# EAGLE design GPS_mk2 (EAGLE 8.4.0)
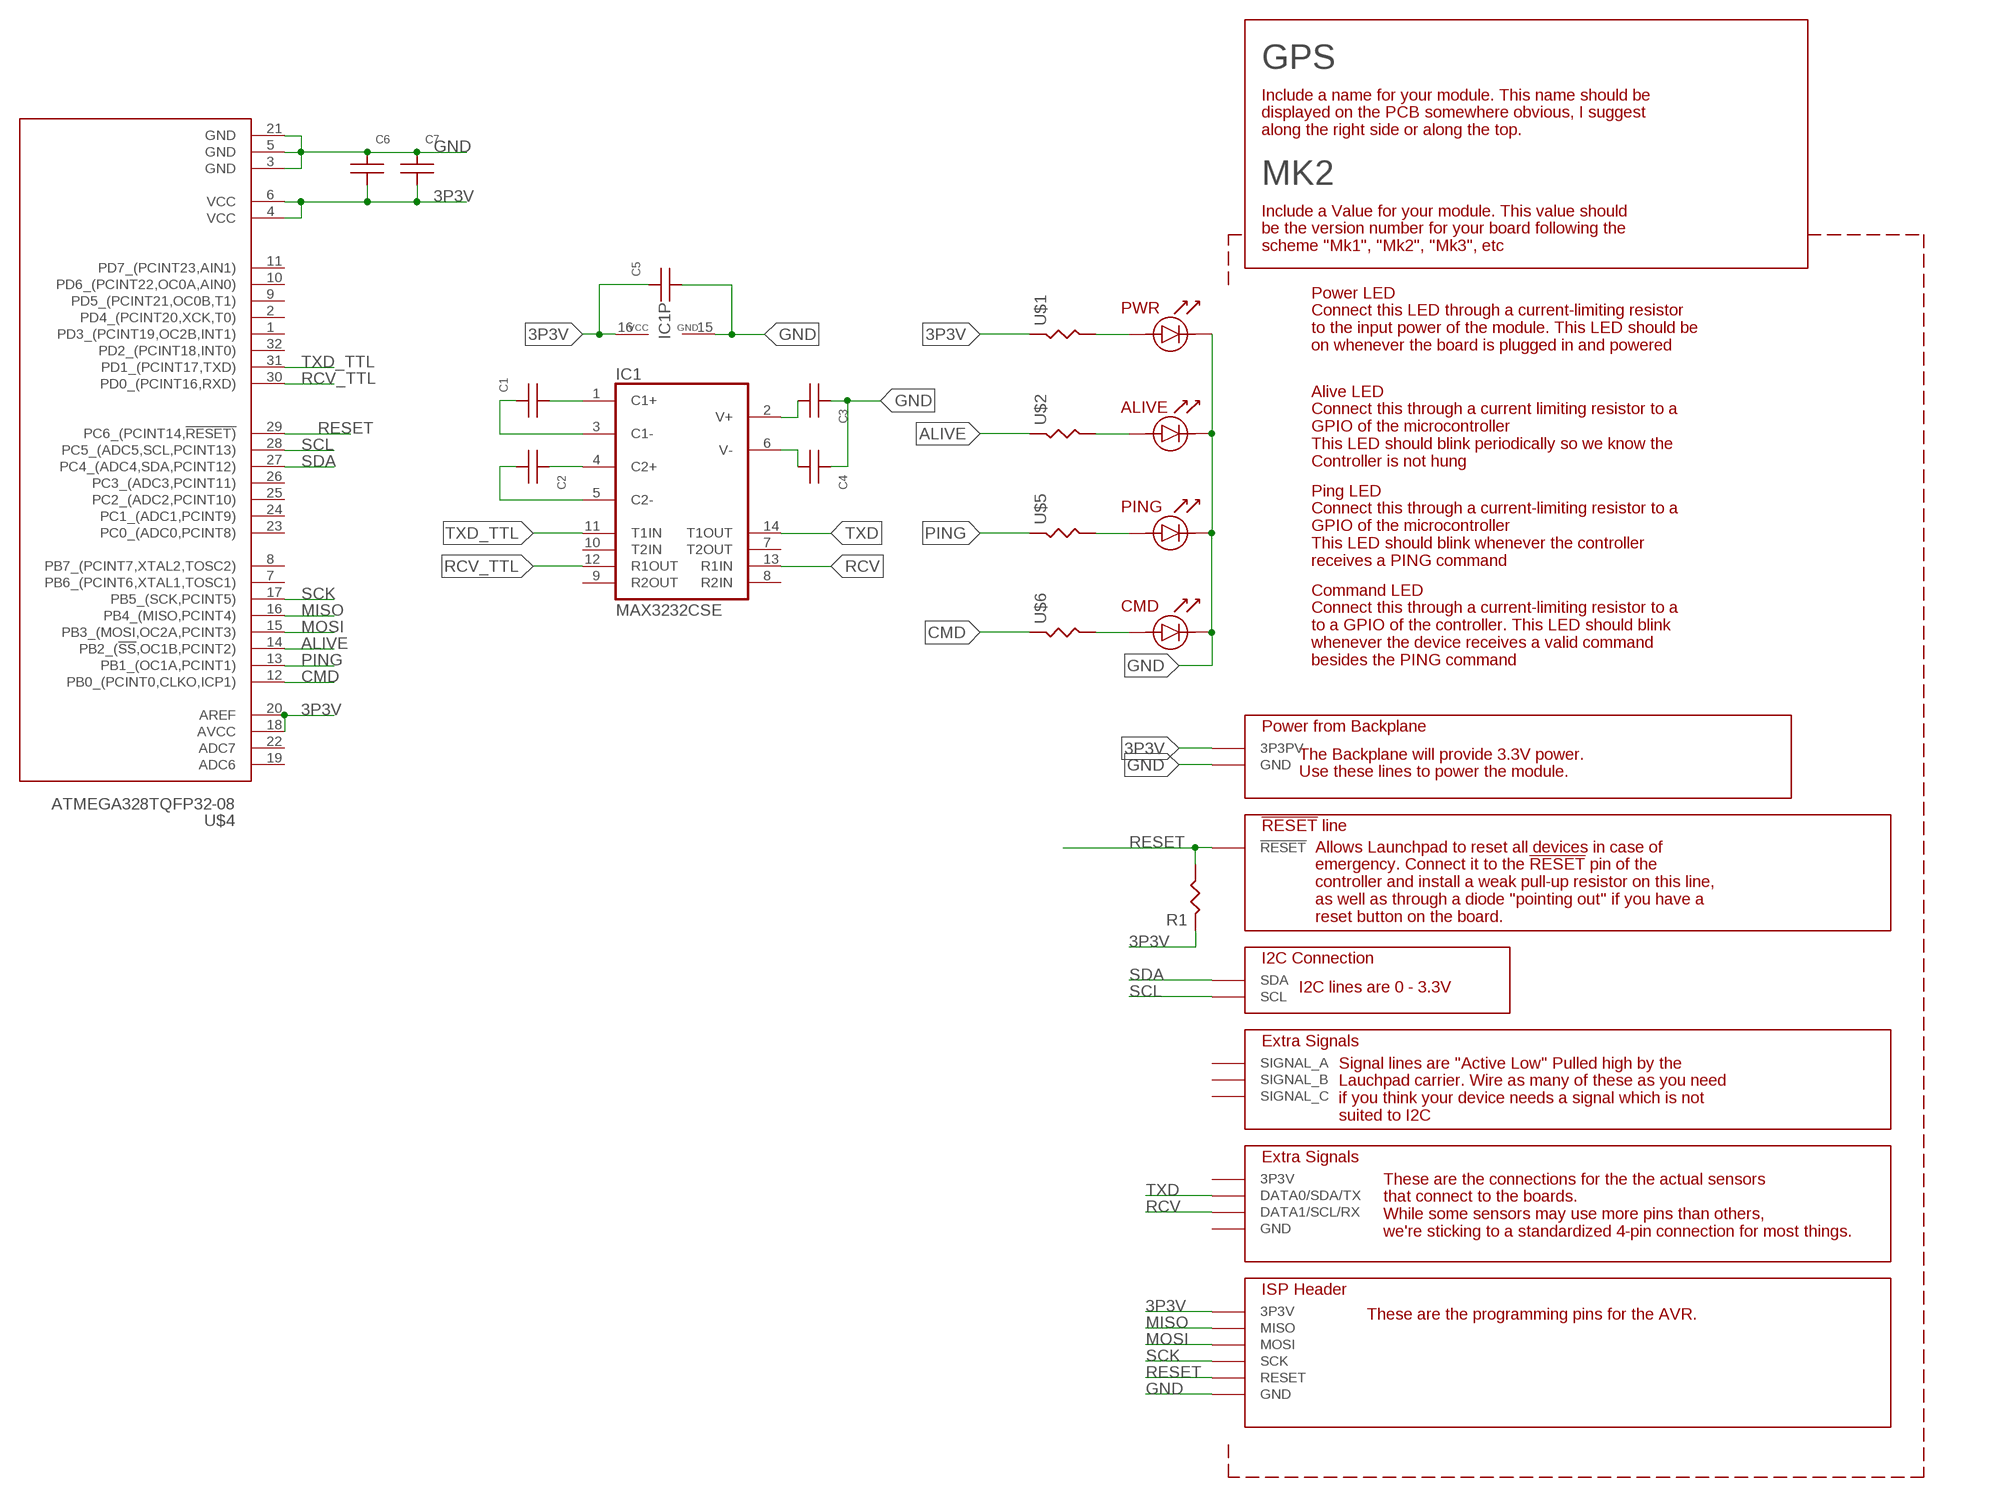
[diagram p0: schematic, sheet 1]

## Parts
C1  CAPACITOR-UNPOLARIZED0805  [0805_STACKPOLERESISTOR]
C2  CAPACITOR-UNPOLARIZED0805  [0805_STACKPOLERESISTOR]
C3  CAPACITOR-UNPOLARIZED0805  [0805_STACKPOLERESISTOR]
C4  CAPACITOR-UNPOLARIZED0805  [0805_STACKPOLERESISTOR]
C5  CAPACITOR-UNPOLARIZED0805  [0805_STACKPOLERESISTOR]
C6  CAPACITOR-UNPOLARIZED0805  [0805_STACKPOLERESISTOR]
C7  CAPACITOR-UNPOLARIZED0805  [0805_STACKPOLERESISTOR]
GPS  MK2  SENSOR_MODULE_MK1  [SENSOR_MODULE_MK1]
IC1  MAX3232CSE  [SO16]
R1  RESISTOR  [0805_STACKPOLERESISTOR]
U$1  RESISTOR  [0805_STACKPOLERESISTOR]
U$2  RESISTOR  [0805_STACKPOLERESISTOR]
U$4  ATMEGA328TQFP32-08  [TQFP32-08]
U$5  RESISTOR  [0805_STACKPOLERESISTOR]
U$6  RESISTOR  [0805_STACKPOLERESISTOR]

## Nets
3P3V: C5.P$1 C6.P$2 C7.P$2 GPS.3P3V@1(3P3PV) GPS.3P3V@4(3P3V) IC1.16(VCC) R1.P$1 U$1.P$1 U$4.4(VCC) U$4.6(VCC) U$4.18(AVCC) U$4.20(AREF)
ALIVE: U$2.P$1 U$4.14(PB2_(!SS,OC1B,PCINT2))
CMD: U$4.12(PB0_(PCINT0,CLKO,ICP1)) U$6.P$1
GND: C3.P$1 C4.P$1 C5.P$2 C6.P$1 C7.P$1 GPS.ALIVELED_CATHODE GPS.CMDLED_CATHODE GPS.GND@1(GND) GPS.GND@4(GND) GPS.PINGLED_CATHODE GPS.PWRLED_CATHODE IC1.15(GND) U$4.3(GND) U$4.5(GND) U$4.21(GND)
MISO: GPS.MISO U$4.16(PB4_(MISO,PCINT4))
MOSI: GPS.MOSI U$4.15(PB3_(MOSI,OC2A,PCINT3))
N$1: C1.P$2 IC1.1(C1+)
N$2: C2.P$1 IC1.4(C2+)
N$3: C1.P$1 IC1.3(C1-)
N$4: C2.P$2 IC1.5(C2-)
N$6: C4.P$2 IC1.6(V-)
N$7: GPS.ALIVELED_ANODE U$2.P$2
N$8: GPS.PWRLED_ANODE U$1.P$2
N$9: GPS.PINGLED_ANODE U$5.P$2
N$10: GPS.CMDLED_ANODE U$6.P$2
N$11: C3.P$2 IC1.2(V+)
PING: U$4.13(PB1_(OC1A,PCINT1)) U$5.P$1
RCV: GPS.DATA1@1(DATA1/SCL/RX) GPS.DATA1@2(DATA1/SCL/RX) IC1.13(R1IN)
RCV_TTL: IC1.12(R1OUT) U$4.30(PD0_(PCINT16,RXD))
RESET: GPS.RESET@1(!RESET) GPS.RESET@2(RESET) R1.P$2 U$4.29(PC6_(PCINT14,!RESET))
SCK: GPS.SCK U$4.17(PB5_(SCK,PCINT5))
SCL: GPS.SCL U$4.28(PC5_(ADC5,SCL,PCINT13))
SDA: GPS.SDA U$4.27(PC4_(ADC4,SDA,PCINT12))
TXD: GPS.DATA0@1(DATA0/SDA/TX) GPS.DATA0@2(DATA0/SDA/TX) IC1.14(T1OUT)
TXD_TTL: IC1.11(T1IN) U$4.31(PD1_(PCINT17,TXD))
Unconnected: GPS.3P3V@2(3P3V) GPS.3P3V@3(3P3V) GPS.A(SIGNAL_A) GPS.B(SIGNAL_B) GPS.C(SIGNAL_C) GPS.GND@2(GND) GPS.GND@3(GND) IC1.7(T2OUT) IC1.8(R2IN) IC1.9(R2OUT) IC1.10(T2IN) U$4.1(PD3_(PCINT19,OC2B,INT1)) U$4.2(PD4_(PCINT20,XCK,T0)) U$4.7(PB6_(PCINT6,XTAL1,TOSC1)) U$4.8(PB7_(PCINT7,XTAL2,TOSC2)) U$4.9(PD5_(PCINT21,OC0B,T1)) U$4.10(PD6_(PCINT22,OC0A,AIN0)) U$4.11(PD7_(PCINT23,AIN1)) U$4.19(ADC6) U$4.22(ADC7) U$4.23(PC0_(ADC0,PCINT8)) U$4.24(PC1_(ADC1,PCINT9)) U$4.25(PC2_(ADC2,PCINT10)) U$4.26(PC3_(ADC3,PCINT11)) U$4.32(PD2_(PCINT18,INT0))

## Library data of the parts
C1-C7 = 000_CustomPartsMaster:CAPACITOR-UNPOLARIZED
GPS = 000_CustomPartsMaster:SENSOR_MODULE_MK1
IC1 = maxim:MAX3232*: True RS-232 Transceivers 3.0V to 5.5V, Low-Power up to 1Mbps, Using Four 0.1µF External Capacitors Source: http://pdfserv.maxim-ic.com/en/ds/MAX3222-MAX3241.pdf; MPN: MAX3232CSE; OC_FARNELL: 9725490; OC_NEWARK: 90C2890
R1 U$1 U$2 U$5 U$6 = 000_CustomPartsMaster:RESISTOR
U$4 = 000_CustomPartsMaster:ATMEGA328

## Board
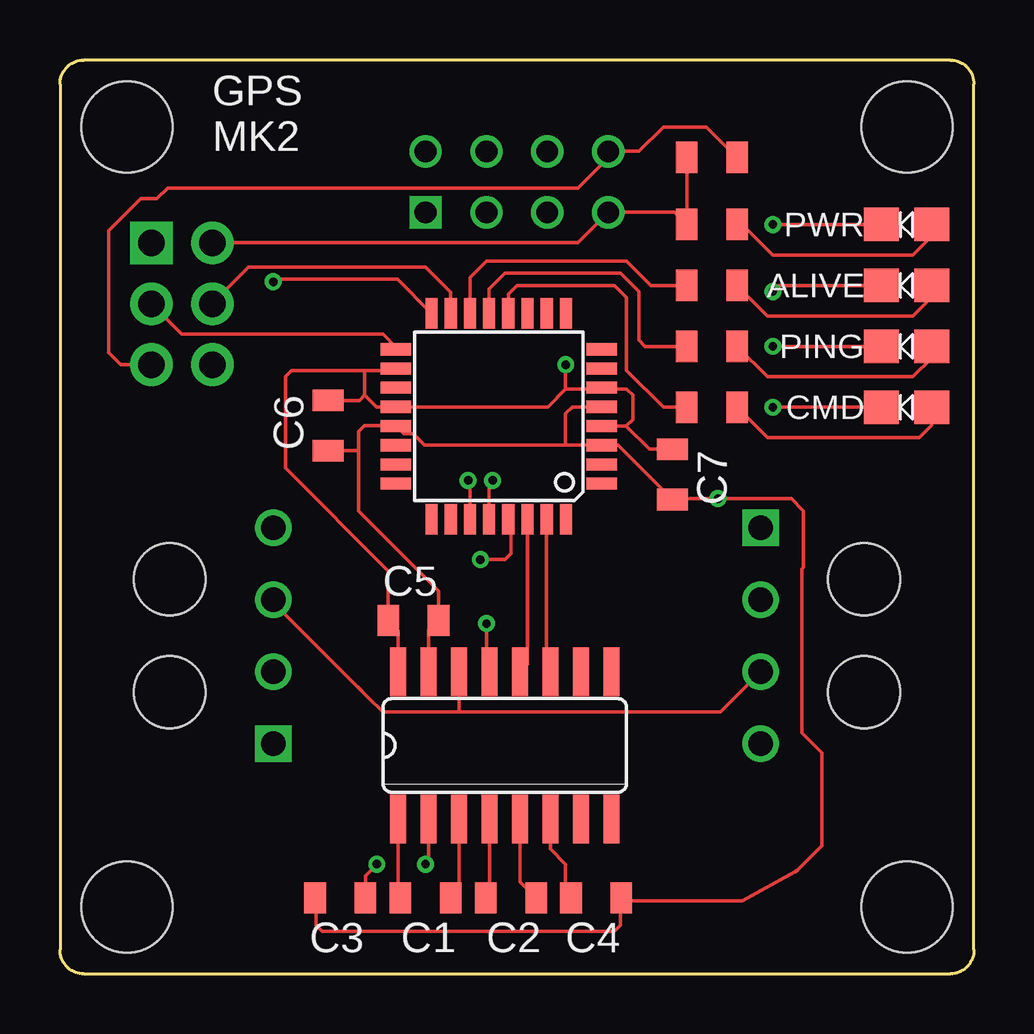
[diagram p1: board, top side]
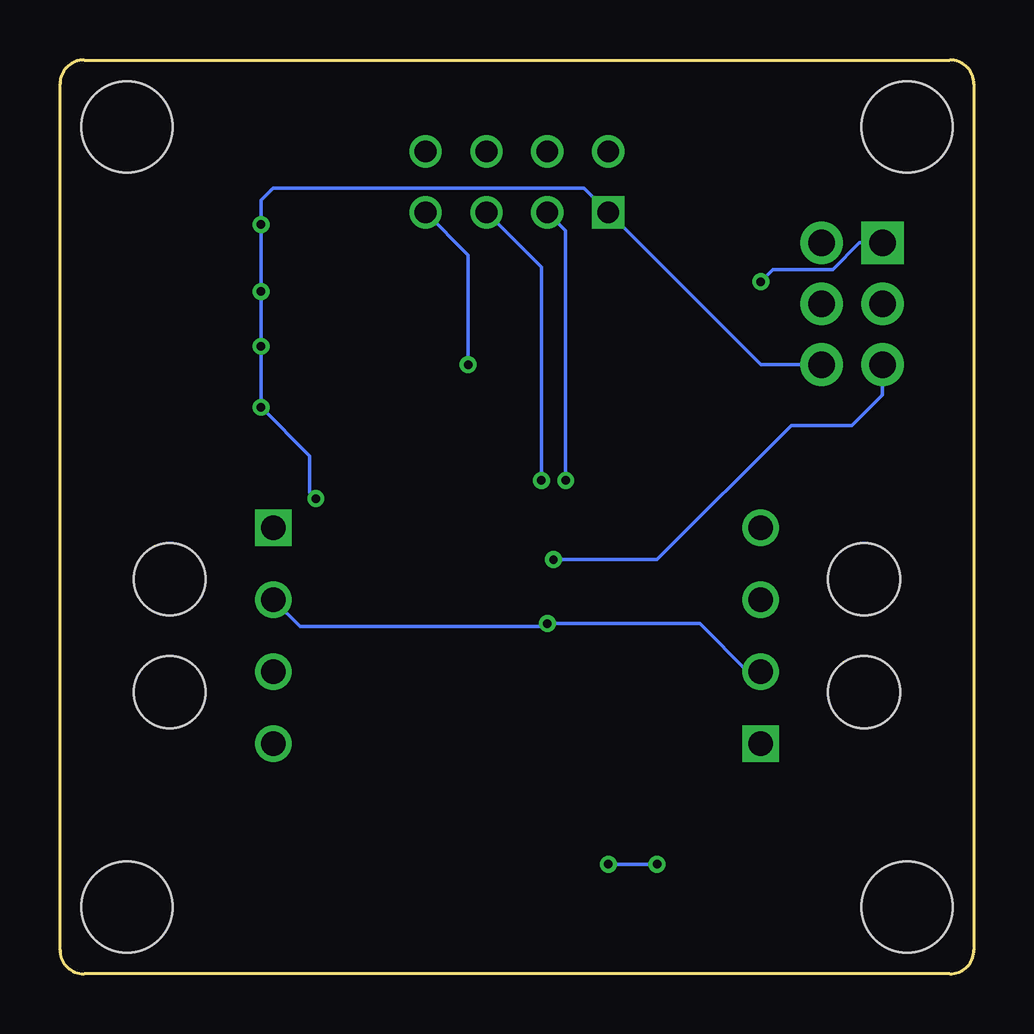
[diagram p2: board, bottom side, seen from below]

Size 38.1 x 38.1 mm. Coordinates in mm from the lower left corner, seen from the top.
Copper layers (1*16): Top 0.0356mm / dielectric 1.5011mm / Bottom 0.0356mm
Design rules "LaenPCBOrder": minimum track width 6mil, minimum drill 13mil, track to track 6mil, track to pad 6mil, pad to pad 6mil, via to via 6mil, smd to smd 6mil, copper to edge 15mil, drill to drill 6mil, minimum pad ring 7mil, minimum via ring 7mil, stop-mask expansion 3mil, vias tented up to drill 0mil, thermal gap 10mil

### Footprints (pad centres in the part's own frame; a part is rotated, then mirrored left to right if it is on the bottom)
0805_STACKPOLERESISTOR = smd 0.9 x 1.3: P$1 -1.05,0; P$2 1.05,0
SENSOR_MODULE_MK1 = drill 0.9: 3P3V@1 22.86,31.75; A 20.32,34.29; B 17.78,34.29; C 15.24,34.29; RESET@1 22.86,34.29; SCL 20.32,31.75; SDA 17.78,31.75 | drill 1.02: 3P3V@2 8.892,18.597; 3P3V@3 29.208,9.597; DATA0@1 8.892,15.597; DATA0@2 29.208,12.597; DATA1@1 8.892,12.597; DATA1@2 29.208,15.597 | drill 1.1 pad 1.778: 3P3V@4 6.35,30.48; GND@4 6.35,25.4; MOSI 6.35,27.94; RESET@2 3.81,25.4; SCK 3.81,27.94 | smd 1.45 x 1.4: ALIVELED_ANODE 36.343,28.702; ALIVELED_CATHODE 34.243,28.702; CMDLED_ANODE 36.343,23.622; CMDLED_CATHODE 34.243,23.622; PINGLED_ANODE 36.343,26.162; PINGLED_CATHODE 34.243,26.162; PWRLED_ANODE 36.343,31.242; PWRLED_CATHODE 34.243,31.242 | drill 0.9 square: GND@1 15.24,31.75 | drill 1.02 square: GND@2 8.892,9.597; GND@3 29.208,18.597 | drill 1.1 pad 1.778 square: MISO 3.81,30.48 | hole 3.797: 2.794,2.794; 35.306,2.794; 2.794,35.306; 35.306,35.306 | hole 3: 4.572,11.747; 4.572,16.447; 33.528,16.447; 33.528,11.747
SO16 = smd 0.66 x 2.032: 1 -4.445,-3.073; 2 -3.175,-3.073; 3 -1.905,-3.073; 4 -0.635,-3.073; 5 0.635,-3.073; 6 1.905,-3.073; 7 3.175,-3.073; 8 4.445,-3.073; 9 4.445,3.073; 10 3.175,3.073; 11 1.905,3.073; 12 0.635,3.073; 13 -0.635,3.073; 14 -1.905,3.073; 15 -3.175,3.073; 16 -4.445,3.073
TQFP32-08 = smd 1.27 x 0.508: 1 -4.293,2.8; 2 -4.293,2; 3 -4.293,1.2; 4 -4.293,0.4; 5 -4.293,-0.4; 6 -4.293,-1.2; 7 -4.293,-2; 8 -4.293,-2.8; 17 4.293,-2.8; 18 4.293,-2; 19 4.293,-1.2; 20 4.293,-0.4; 21 4.293,0.4; 22 4.293,1.2; 23 4.293,2; 24 4.293,2.8 | smd 0.508 x 1.27: 9 -2.8,-4.293; 10 -2,-4.293; 11 -1.2,-4.293; 12 -0.4,-4.293; 13 0.4,-4.293; 14 1.2,-4.293; 15 2,-4.293; 16 2.8,-4.293; 25 2.8,4.293; 26 2,4.293; 27 1.2,4.293; 28 0.4,4.293; 29 -0.4,4.293; 30 -1.2,4.293; 31 -2,4.293; 32 -2.8,4.293

### Placement (x,y rotation side)
C1  15.24,3.17 180 top
C2  18.8,3.17 0 top
C3  11.68,3.17 0 top
C4  22.35,3.17 180 top
C5  14.73,14.73 0 top
C6  11.18,22.86 90 top
C7  25.53,20.83 90 top
GPS  0,0 0 top
IC1  18.54,9.53 0 top
R1  27.18,34.04 0 top
U$1  27.18,31.24 0 top
U$2  27.18,28.7 0 top
U$4  18.29,23.24 180 top
U$5  27.18,26.16 0 top
U$6  27.18,23.62 0 top

### Tracks (layer width: path | path; a pad name or v marks a point on that pad's centre or on a via)
3P3V  (via drill 0.35)
  Top 0.152: 26.02,31.35 25.62,31.75 GPS.3P3V@1 21.59,30.48 GPS.3P3V@4 | 26.02,31.35 U$1.P$1 | IC1.16 14.1,14.32 C5.P$1 13.68,16.8 9.4,21.08 9.4,24.89 9.65,25.15 12.7,25.15 | 12.7,25.15 13.9,25.15 U$4.18 | 12.7,24.13 12.7,25.15 | 12.7,24.13 13.21,23.62 13.98,23.62 U$4.20 20.34,23.64 21.08,24.38 | 21.08,24.38 22.52,24.38 U$4.6 22.64,24.38 23.62,24.38 23.88,24.13 23.88,23.11 23.6,22.84 | 21.08,24.38 v21.08,25.4 | 23.6,22.84 U$4.4 | C6.P$2 12.48,23.91 12.7,24.13 | 23.6,22.84 24.57,21.88 C7.P$2 | R1.P$1 26.13,31.46 26.02,31.35
  Bottom 0.152: v21.08,25.4 21.08,29.97 GPS.3P3V@1
ALIVE
  Top 0.152: U$4.14 17.09,29.03 17.78,29.72 23.62,29.72 24.64,28.7 U$2.P$1
CMD
  Top 0.152: U$4.12 18.69,28.34 19.05,28.7 23.11,28.7 23.62,28.19 23.62,25.15 25.15,23.62 U$6.P$1 25.87,23.37
GND  (via drill 0.35)
  Top 0.152: GPS.PWRLED_CATHODE v29.72,31.24 | v29.72,28.45 29.97,28.7 GPS.ALIVELED_CATHODE | GPS.PINGLED_CATHODE v29.72,26.16 | GPS.CMDLED_CATHODE v29.72,23.62 | IC1.15 15.37,14.32 C5.P$2 15.78,15.97 12.45,19.3 12.45,21.73 | 21.08,22.04 15.21,22.04 14.72,22.52 14.31,22.52 U$4.21 13.98,22.86 12.7,22.86 12.45,22.61 12.45,21.73 | 21.08,22.04 U$4.3 23.26,22.04 C7.P$1 | U$4.5 21.36,23.64 21.08,23.37 21.08,22.04 | 30.73,4.32 30.63,4.26 | 30.63,4.26 28.45,3.05 23.53,3.05 C4.P$1 23.37,3.14 23.37,2.03 23.11,1.78 10.92,1.78 10.67,2.03 10.67,3.14 C3.P$1 | C6.P$1 12.37,21.81 12.45,21.73 | C7.P$1 26.25,19.81 | C7.P$1 26.32,19.81 v27.43,19.81 30.48,19.81 30.99,19.3 30.99,16.94 30.94,16.89 30.94,10.04 31.75,9.22 31.75,5.33 30.67,4.26 30.63,4.26
  Bottom 0.152: v27.43,19.81 27.69,20.07 27.69,21.59 v29.72,23.62 v29.72,26.16 v29.72,28.45 v29.72,31.24 29.72,32.26 29.21,32.77 16.26,32.77 GPS.GND@1 8.89,25.4 GPS.GND@4
MISO  (via drill 0.35)
  Top 0.152: 15.46,27.56 U$4.16 14.07,28.96 8.99,28.96 v8.89,28.86
  Bottom 0.152: v8.89,28.86 8.38,29.36 5.89,29.36 4.77,30.48 GPS.MISO
MOSI
  Top 0.152: GPS.MOSI 7.87,29.46 15.24,29.46 16.29,28.42 U$4.15
N$1
  Top 0.152: C1.P$2 14.1,3.27 IC1.1
N$2
  Top 0.152: C2.P$1 17.91,3.34 IC1.4
N$3
  Top 0.152: C1.P$1 16.64,3.52 IC1.3
N$4
  Top 0.152: C2.P$2 19.18,3.84 IC1.5
N$6
  Top 0.152: IC1.6 20.45,5.21 21.08,4.57 21.08,3.4 C4.P$2
N$7
  Top 0.152: U$2.P$2 29.5,27.43 35.56,27.43 36.34,28.21 GPS.ALIVELED_ANODE
N$8
  Top 0.152: U$1.P$2 28.45,31.24 29.72,29.97 35.56,29.97 36.34,30.75 GPS.PWRLED_ANODE
N$9
  Top 0.152: U$5.P$2 29.5,24.89 35.56,24.89 36.34,25.68 GPS.PINGLED_ANODE
N$10
  Top 0.152: U$6.P$2 29.5,22.35 35.81,22.35 36.34,22.88 GPS.CMDLED_ANODE
N$11  (via drill 0.35)
  Top 0.152: IC1.2 15.37,4.7 v15.24,4.57 | v13.21,4.57 12.73,4.1 C3.P$2
  Bottom 0.152: v15.24,4.57 v13.21,4.57
PING
  Top 0.152: U$4.13 17.89,28.56 18.54,29.21 23.37,29.21 24.13,28.45 24.13,26.42 24.38,26.16 U$5.P$1
RCV  (via drill 0.35)
  Top 0.152: IC1.13 17.78,12.72 v17.78,14.61
  Bottom 0.152: GPS.DATA1@1 9.42,12.6 11.43,14.61 v17.78,14.61 17.91,14.48 28.09,14.48 GPS.DATA1@2
RCV_TTL
  Top 0.152: IC1.12 19.49,12.91 U$4.30
RESET  (via drill 0.35)
  Top 0.152: v17.53,17.27 18.54,17.27 18.8,17.53 18.8,18.84 U$4.29 | R1.P$2 26.96,35.31 25.15,35.31 24.13,34.29 GPS.RESET@1 22.86,34.04 21.59,32.77 4.48,32.77 4.03,32.31 3.36,32.31 2.03,30.99 2.03,25.91 2.54,25.4 GPS.RESET@2
  Bottom 0.152: v17.53,17.27 13.21,17.27 7.62,22.86 5.08,22.86 3.81,24.13 GPS.RESET@2
SCK
  Top 0.152: GPS.SCK 5.08,26.67 13.46,26.67 13.99,26.14 U$4.17
SCL  (via drill 0.35)
  Top 0.152: U$4.28 17.89,20.43 v18.03,20.57
  Bottom 0.152: v18.03,20.57 18.03,29.46 GPS.SCL
SDA  (via drill 0.35)
  Top 0.152: U$4.27 17.09,20.5 v17.02,20.57
  Bottom 0.152: v17.02,20.57 17.02,30.99 GPS.SDA
TXD
  Top 0.152: IC1.14 16.64,10.92 | 12.83,11.56 12.42,11.96 | 12.83,11.56 13.46,10.92 16.64,10.92 | GPS.DATA0@2 27.53,10.92 16.64,10.92 | GPS.DATA0@1 8.89,15.49 12.83,11.56
TXD_TTL
  Top 0.152: IC1.11 20.29,12.76 U$4.31